# EAGLE design little-endian (EAGLE 8.7.1)
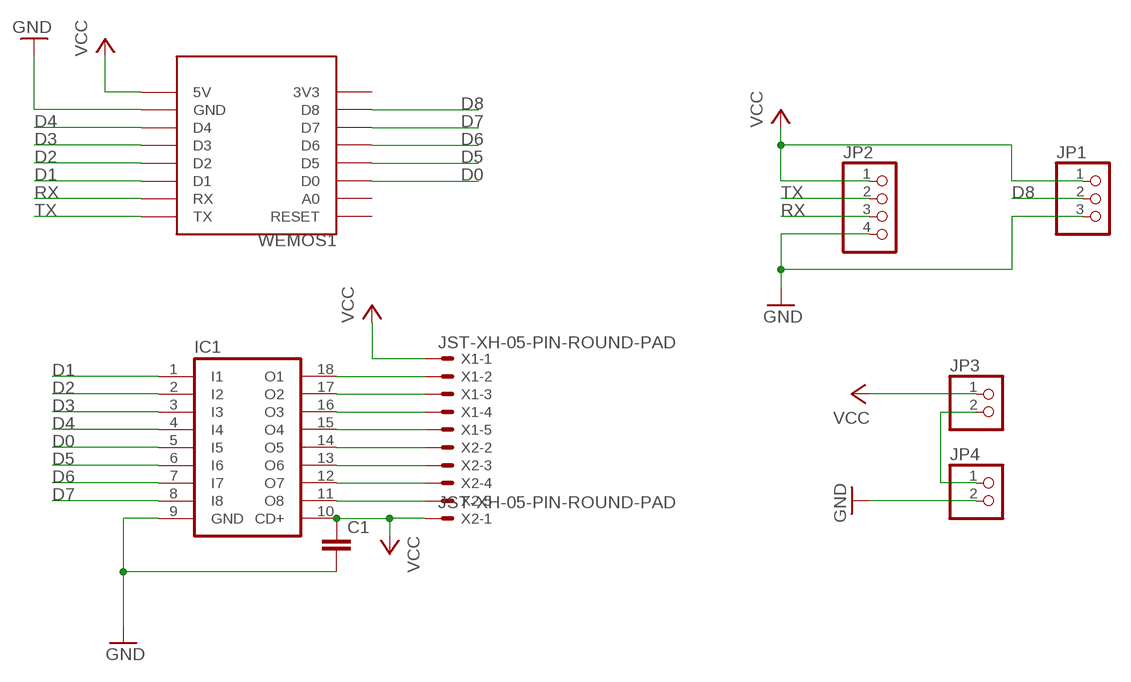
[diagram p0: schematic, sheet 1]

## Parts
C1  C-EU050-030X075  [C050-030X075]
IC1  ULN2803A  [DIL18]
JP1  PINHD-1X3  [1X03]
JP2  PINHD-1X4  [1X04]
JP3  PINHD-1X2  [1X02]
JP4  PINHD-1X2  [1X02]
WEMOS1  WEMOS-D1-MINI  [WEMOS-D1-MINI]
X1  JST-XH-05-PIN-ROUND-PAD  [JST-XH-05-PACKAGE-ROUND-PAD]
X2  JST-XH-05-PIN-ROUND-PAD  [JST-XH-05-PACKAGE-ROUND-PAD]

## Nets
D0: IC1.5(I5) WEMOS1.D0
D1: IC1.1(I1) WEMOS1.D1
D2: IC1.2(I2) WEMOS1.D2
D3: IC1.3(I3) WEMOS1.D3
D4: IC1.4(I4) WEMOS1.D4
D5: IC1.6(I6) WEMOS1.D5
D6: IC1.7(I7) WEMOS1.D6
D7: IC1.8(I8) WEMOS1.D7
D8: JP1.2 WEMOS1.D8
GND: C1.2 IC1.9(GND) JP1.3 JP2.4 JP4.2 WEMOS1.GND
N$1: JP3.2 JP4.1
N$9: IC1.11(O8) X2.5
N$10: IC1.12(O7) X2.4
N$11: IC1.13(O6) X2.3
N$12: IC1.14(O5) X2.2
N$13: IC1.15(O4) X1.5
N$14: IC1.16(O3) X1.4
N$15: IC1.17(O2) X1.3
N$16: IC1.18(O1) X1.2
RX: JP2.3 WEMOS1.RX
TX: JP2.2 WEMOS1.TX
VCC: C1.1 IC1.10(CD+) JP1.1 JP2.1 JP3.1 WEMOS1.5V X1.1 X2.1
Unconnected: WEMOS1.3V3 WEMOS1.A0 WEMOS1.RESET

## Library data of the parts
C1 = rcl:C-EU: CAPACITOR, European symbol; SPICEPREFIX: C
IC1 = uln-udn:ULN2803A: DRIVER ARRAY
JP1 = pinhead:PINHD-1X3: PIN HEADER
JP2 = pinhead:PINHD-1X4: PIN HEADER
JP3 JP4 = pinhead:PINHD-1X2: PIN HEADER
WEMOS1 = esp8266modules:WEMOS-D1-MINI: WeMos.cc D1 mini ESP8266 module
X1 X2 = Rembrandt Electronics - JST XH Connectors v1-0:JST-XH-05-PIN: JST XH Connector 2 Pin Wire to board connector. Pitch: 2,54 mm, (0.100") Number of pins: 5 Created by Rembrandt Electronics www.rembrandtelectronics.com

## Board
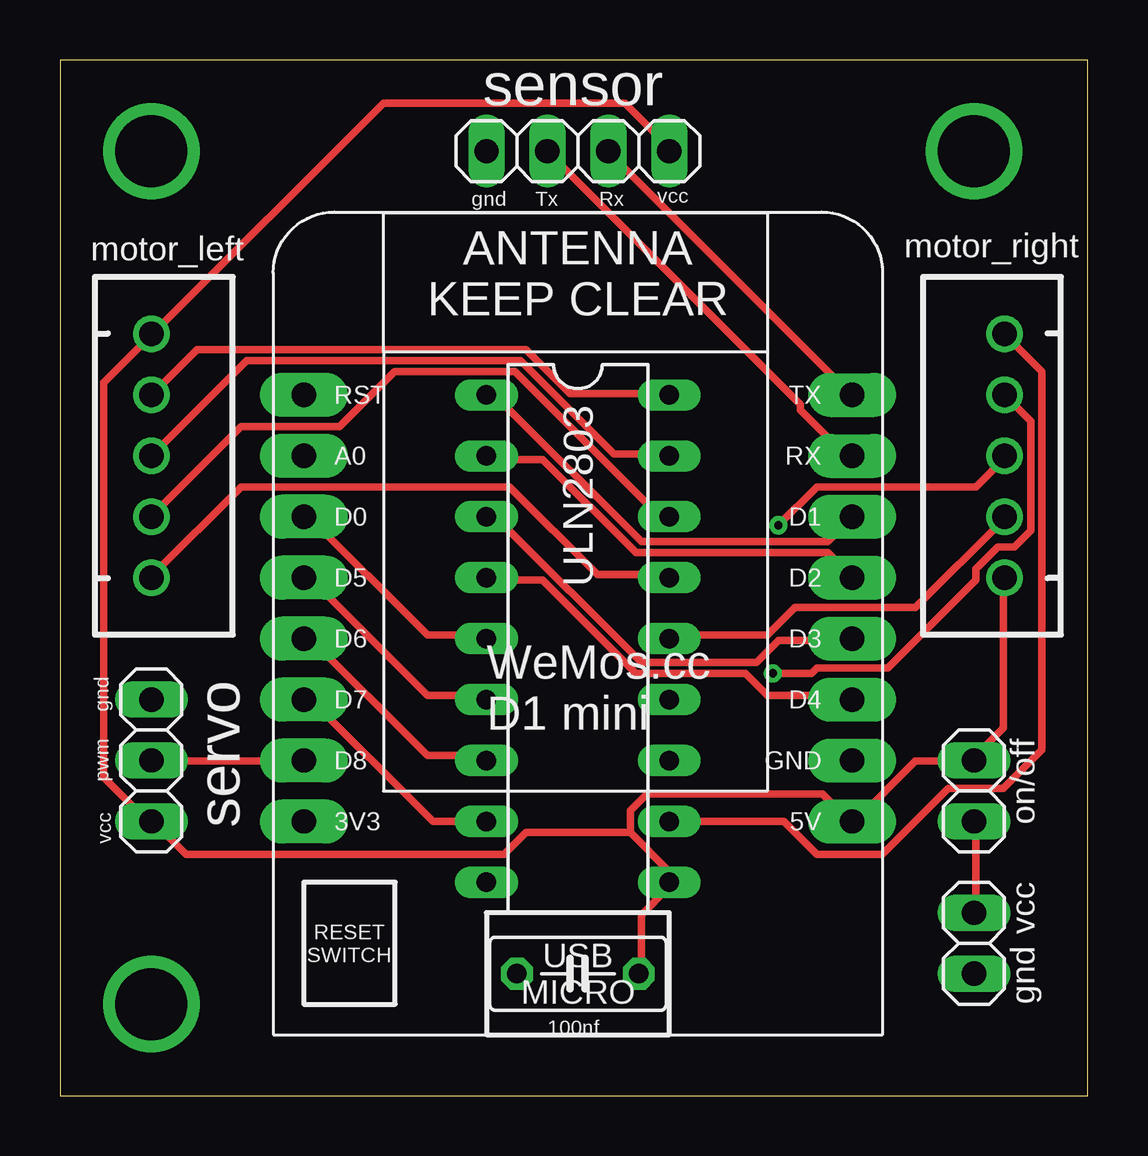
[diagram p1: board, top side]
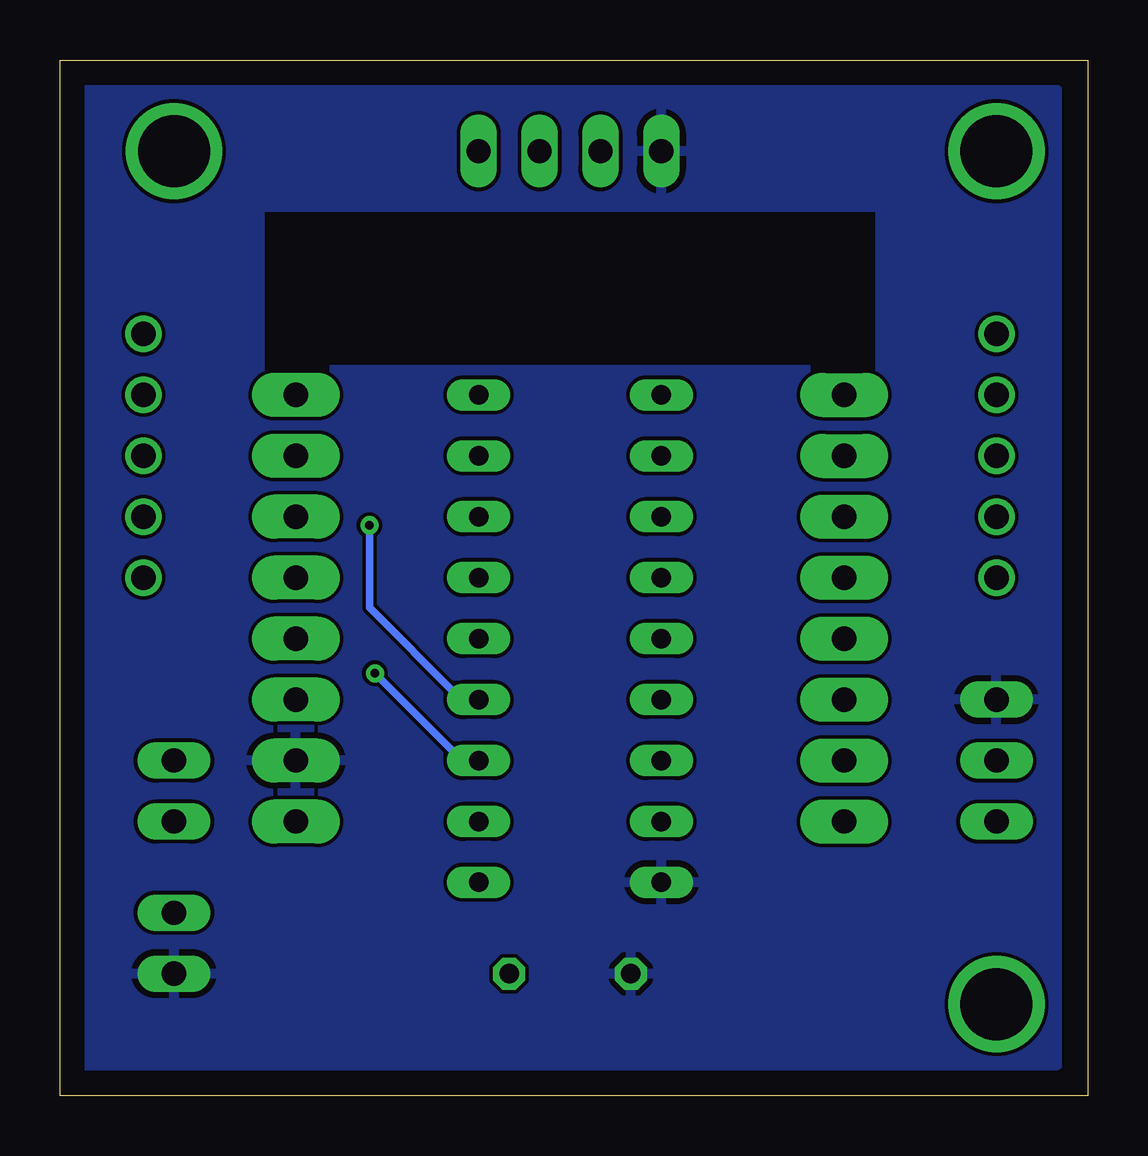
[diagram p2: board, bottom side, seen from below]

Size 42.85 x 43.17 mm. Coordinates in mm from the lower left corner, seen from the top.
Outline: 0,0 42.85,0 42.85,43.17 0,43.17 0,0
Copper layers (1*16): Top 0.035mm / dielectric 1.5mm / Bottom 0.035mm
Design rules "default *": minimum track width 12mil, minimum drill 0.35mm, track to track 6mil, track to pad 6mil, pad to pad 6mil, via to via 6mil, smd to smd 6mil, copper to edge 40mil, drill to drill 6mil, minimum pad ring 10mil, minimum via ring 8mil, stop-mask expansion 4mil, vias tented up to drill 0mil, thermal gap 10mil
bRestrict: area 8.9,30.5 to 34.3,36.8

### Footprints (pad centres in the part's own frame; a part is rotated, then mirrored left to right if it is on the bottom)
C050-030X075 = drill 0.813 octagon: 1 -2.54,0; 2 2.54,0
DIL18 = drill 0.813 long: 1 -10.16,-3.81; 2 -7.62,-3.81; 3 -5.08,-3.81; 4 -2.54,-3.81; 5 0,-3.81; 6 2.54,-3.81; 7 5.08,-3.81; 8 7.62,-3.81; 9 10.16,-3.81; 10 10.16,3.81; 11 7.62,3.81; 12 5.08,3.81; 13 2.54,3.81; 14 0,3.81; 15 -2.54,3.81; 16 -5.08,3.81; 17 -7.62,3.81; 18 -10.16,3.81
1X03 = drill 1.016 long: 1 -2.54,0; 2 0,0; 3 2.54,0
1X04 = drill 1.016 long: 1 -3.81,0; 2 -1.27,0; 3 1.27,0; 4 3.81,0
1X02 = drill 1.016 long: 1 -1.27,0; 2 1.27,0
WEMOS-D1-MINI = drill 1.016 pad 1.829 long: 3V3 -10.16,-10.16; 5V 12.7,-10.16; A0 -10.16,5.08; D0 -10.16,2.54; D1 12.7,2.54; D2 12.7,0; D3 12.7,-2.54; D4 12.7,-5.08; D5 -10.16,0; D6 -10.16,-2.54; D7 -10.16,-5.08; D8 -10.16,-7.62; GND 12.7,-7.62; RESET -10.16,7.62; RX 12.7,5.08; TX 12.7,7.62
JST-XH-05-PACKAGE-ROUND-PAD = drill 1.016: 1 -5.08,0; 2 -2.54,0; 3 0,0; 4 2.54,0; 5 5.08,0

### Placement (x,y rotation side)
C1  21.59,5.08 180 top
IC1  21.59,19.05 270 top
JP1  3.81,13.97 90 top
JP2  21.59,39.37 180 top
JP3  38.1,12.7 270 top
JP4  38.1,6.35 270 top
WEMOS1  20.32,21.59 0 top
X1  3.81,26.67 270 top
X2  39.37,26.67 90 top

### Tracks (layer width: path | path; a pad name or v marks a point on that pad's centre or on a via)
D0
  Top 0.305: IC1.5 17.6,19.2 15.32,19.2 10.29,24.23 WEMOS1.D0
D1
  Top 0.305: IC1.1 17.83,29.03 18.29,29.03 24.23,23.09 32,23.09 32.92,24 WEMOS1.D1
D2
  Top 0.305: IC1.2 17.83,26.52 20.12,26.52 24,22.63 32,22.63 32.92,21.72 WEMOS1.D2
D3
  Top 0.305: IC1.3 17.83,24 18.29,24 24.23,18.06 29.03,18.06 29.95,18.97 32.92,18.97 WEMOS1.D3
D4
  Top 0.305: IC1.4 17.83,21.49 20.12,21.49 24,17.6 28.57,17.6 29.49,16.69 32.92,16.69 WEMOS1.D4
D5
  Top 0.305: IC1.6 17.6,16.69 15.32,16.69 10.29,21.72 WEMOS1.D5
D6
  Top 0.305: IC1.7 17.6,14.17 15.32,14.17 10.29,19.2 WEMOS1.D6
D7
  Top 0.305: IC1.8 15.54,11.43 10.29,16.69 WEMOS1.D7
D8
  Top 0.305: JP1.2 3.89,13.95 10.06,13.95 WEMOS1.D8
GND
  pour Bottom: 1.27,1.27 1.27,41.91 41.91,41.91 41.91,1.27
N$1
  Top 0.305: JP4.1 38.18,7.77 38.18,11.43 JP3.2
N$2  (via drill 3)
  other vias: 3.81,3.81
N$3  (via drill 3)
  other vias: 38.1,39.37
N$4  (via drill 3)
  other vias: 3.81,39.37
N$9
  Top 0.305: IC1.11 30.18,11.43 31.55,10.06 34.29,10.06 37.03,12.8 39.32,12.8 40.92,14.4 40.92,30.18 39.55,31.55 X2.5
N$10  (via drill 0.35)
  Top 0.305: v29.72,17.6 31.32,17.6 31.55,17.83 34.52,17.83 38.18,21.49 38.18,21.95 39.09,22.86 39.78,22.86 40.46,23.55 40.46,28.12 X2.4
  Bottom 0.305: v29.72,17.6 26.29,14.17 25.6,14.17 IC1.12
N$11  (via drill 0.35)
  Top 0.305: v29.95,23.77 31.55,25.38 38.18,25.38 39.32,26.52 X2.3
  Bottom 0.305: v29.95,23.77 29.95,20.34 26.29,16.69 25.6,16.69 IC1.13
N$12
  Top 0.305: IC1.14 25.6,19.2 29.49,19.2 30.63,20.34 35.66,20.34 39.32,24 X2.2
N$13
  Top 0.305: IC1.15 25.38,21.72 22.4,21.72 18.75,25.38 7.54,25.38 3.89,21.72 X1.5
N$14
  Top 0.305: IC1.16 25.38,24.23 24.92,24.23 18.97,30.18 13.95,30.18 11.66,27.89 7.54,27.89 3.89,24.23 X1.4
N$15
  Top 0.305: X1.3 7.77,30.63 19.2,30.63 23.09,26.75 25.38,26.75 IC1.17
N$16
  Top 0.305: IC1.18 25.38,29.26 21.26,29.26 19.43,31.09 5.71,31.09 3.89,29.26 X1.2
RX
  Top 0.305: JP2.3 20.34,39.32 30.86,28.8 30.86,28.57 32.92,26.52 WEMOS1.RX
TX
  Top 0.305: JP2.2 22.86,39.32 32.92,29.26 WEMOS1.TX
VCC
  Top 0.305: C1.1 24.23,5.26 24.23,7.54 25.38,8.69 IC1.10 25.38,8.91 25.38,9.37 23.77,10.97 | X2.1 39.32,21.49 39.32,15.32 38.18,14.17 JP3.1 37.95,13.95 35.66,13.95 33.15,11.43 WEMOS1.5V 32.92,11.43 31.77,12.57 24.46,12.57 23.77,11.89 23.77,10.97 | 23.77,10.97 19.43,10.97 18.52,10.06 5.26,10.06 3.89,11.43 JP1.1 3.66,11.43 1.83,13.26 1.83,29.72 3.66,31.55 X1.1 3.89,31.77 13.49,41.38 23.55,41.38 25.38,39.55 JP2.1

### Text on the board
tNames: sensor | gnd | Tx | Rx | vcc | motor_left | motor_right | ULN2803 | gnd | pwm | vcc | servo | on/off | vcc | gnd | 100nf